# Altium project AltiumSTM32_ExamplePCB.PrjPcb
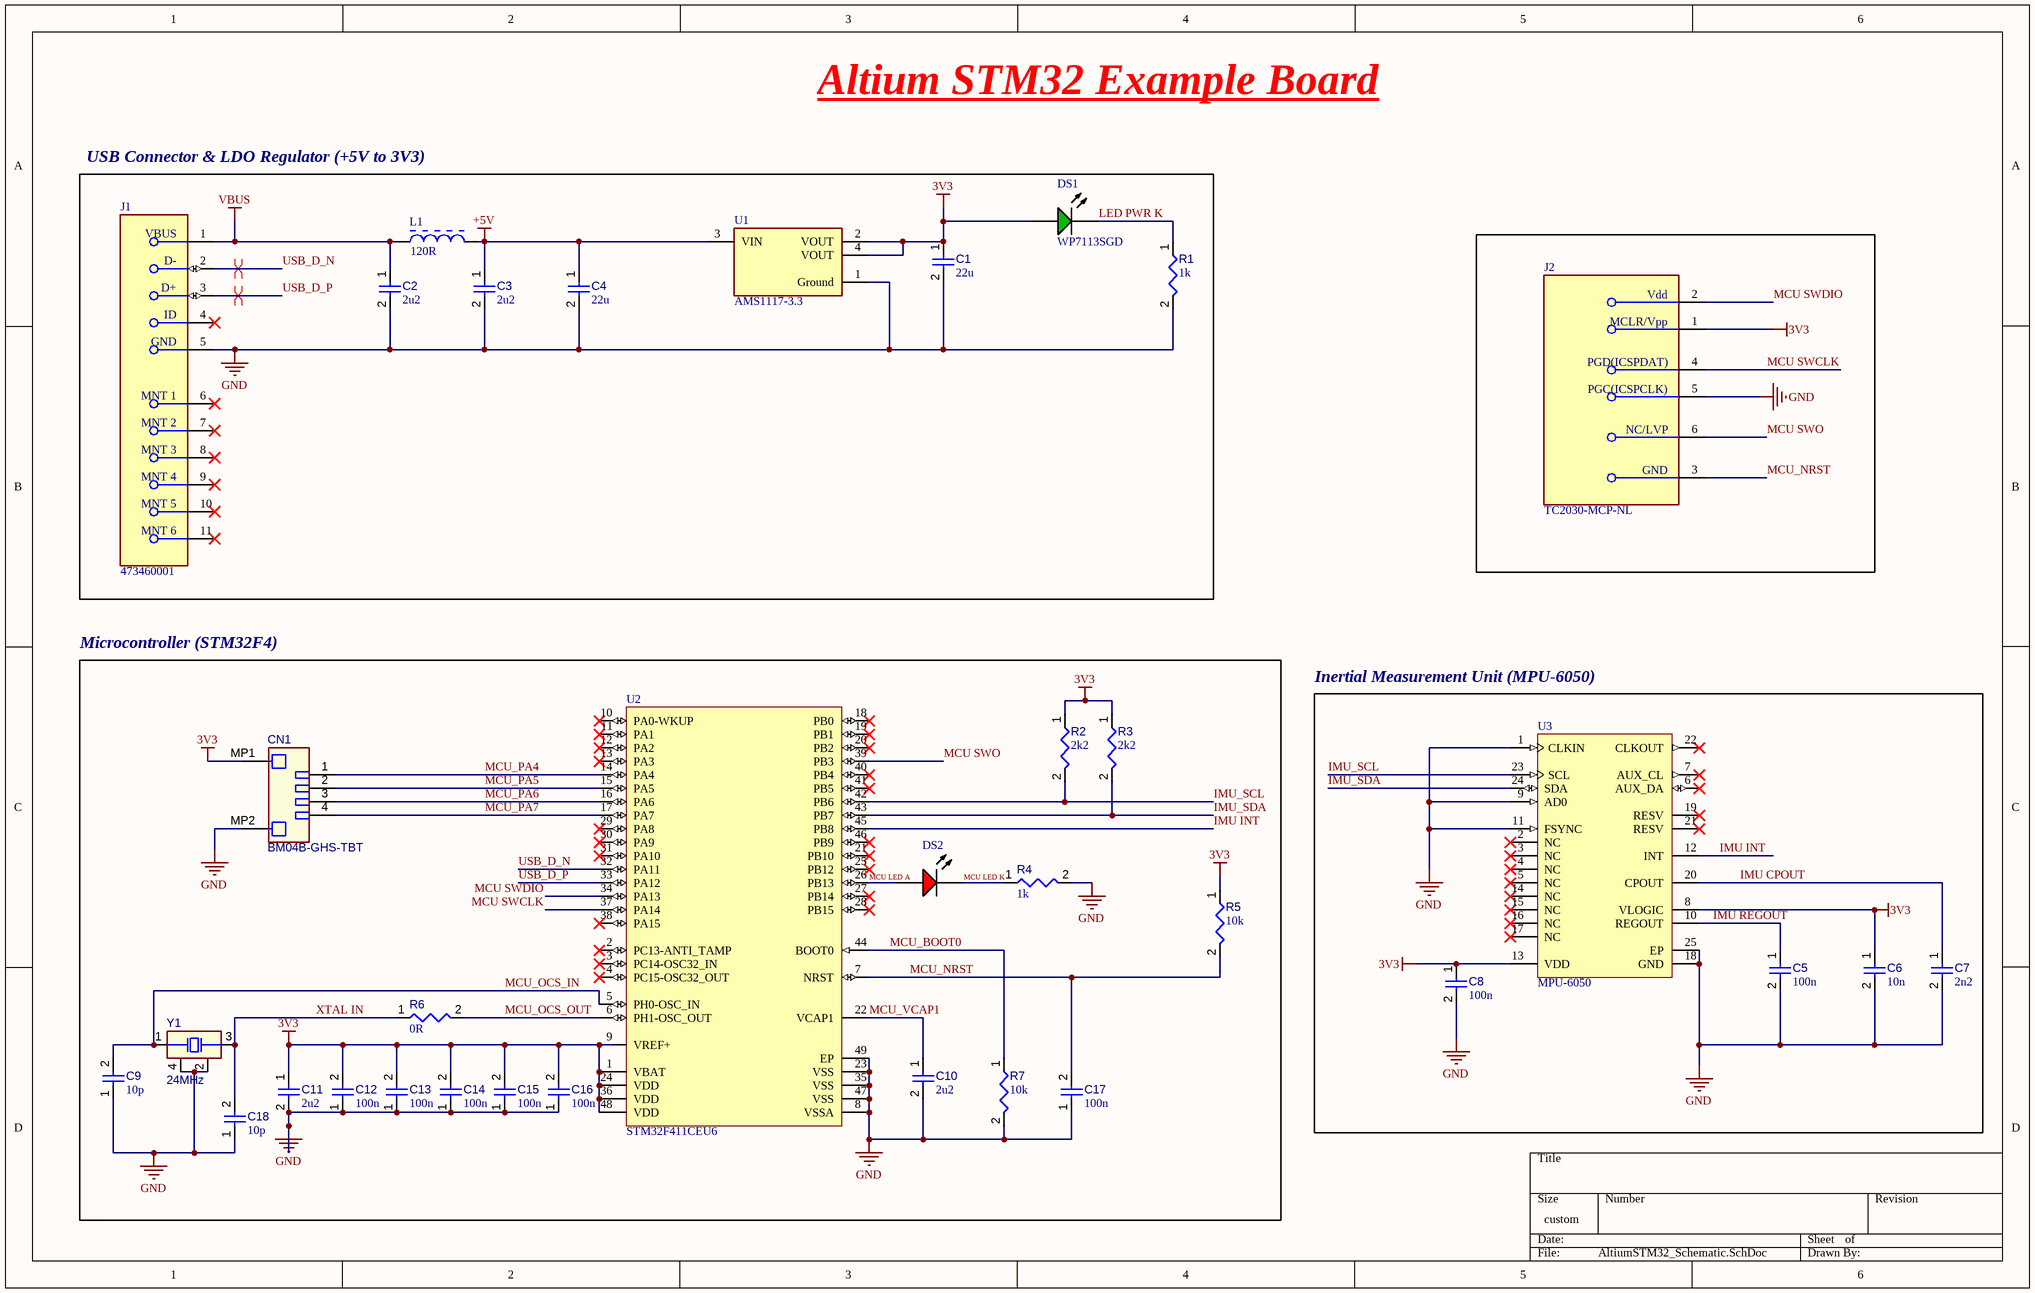
[diagram p0: AltiumSTM32_Schematic.SchDoc]
1 sheet, 35 parts. Net scope: global (net labels, ports and power ports of the same name join across sheets).
Board file: AltiumSTM32_PCB.PcbDoc

## Sheet AltiumSTM32_Schematic.SchDoc
size 381 x 241 mm; SheetNumber: 1; SheetTotal: 1

### Parts
C1  value 22u  [CAPC0805(2012)145_L]  (hidden comment: Capacitor 22µF +/-40% 16V 0805)
C2  value 2u2  [CAPC1608X94X35NL15T15]  (hidden comment: Capacitor 1 uF +/- 10% 16 V 0603)
C3  value 2u2  [CAPC1608X94X35NL15T15]  (hidden comment: Capacitor 1 uF +/- 10% 16 V 0603)
C4  value 22u  [CAPC0805(2012)145_L]  (hidden comment: Capacitor 22µF +/-40% 16V 0805)
C5  value 100n  [CAPC1005X56X25LL10T15]  (hidden comment: Capacitor 0.1 uF +/- 5% 16 V 0402)
C6  value 10n  [CAPC1005X56X25LL10T15]  (hidden comment: Capacitor 0.1 uF +/- 5% 16 V 0402)
C7  value 2n2  [CAPC1005X56X25LL10T15]  (hidden comment: Capacitor 0.1 uF +/- 5% 16 V 0402)
C8  value 100n  [CAPC1005X56X25LL10T15]  (hidden comment: Capacitor 0.1 uF +/- 5% 16 V 0402)
C9  value 10p  [CAPC1005X56X25NL10T15]  (hidden comment: Capacitor 6.8 nF +/- 10% 16 V 0402)
C10  value 2u2  [CAPC1608X94X35NL15T15]  (hidden comment: Capacitor 1 uF +/- 10% 16 V 0603)
C11  value 2u2  [CAPC1608X94X35NL15T15]  (hidden comment: Capacitor 1 uF +/- 10% 16 V 0603)
C12  value 100n  [CAPC1005X56X25LL10T15]  (hidden comment: Capacitor 0.1 uF +/- 5% 16 V 0402)
C13  value 100n  [CAPC1005X56X25LL10T15]  (hidden comment: Capacitor 0.1 uF +/- 5% 16 V 0402)
C14  value 100n  [CAPC1005X56X25LL10T15]  (hidden comment: Capacitor 0.1 uF +/- 5% 16 V 0402)
C15  value 100n  [CAPC1005X56X25LL10T15]  (hidden comment: Capacitor 0.1 uF +/- 5% 16 V 0402)
C16  value 100n  [CAPC1005X56X25LL10T15]  (hidden comment: Capacitor 0.1 uF +/- 5% 16 V 0402)
C17  value 100n  [CAPC1005X56X25LL10T15]  (hidden comment: Capacitor 0.1 uF +/- 5% 16 V 0402)
C18  value 10p  [CAPC1005X56X25NL10T15]  (hidden comment: Capacitor 6.8 nF +/- 10% 16 V 0402)
CN1  BM04B-GHS-TBT  [JST-BM04B-GHS-TBT_V]
DS1  WP7113SGD  [KING-WP7113SGD_V]
DS2  UR502DC  [CGX-UR502DC]  (value not drawn)
J1  473460001  [FP-473460001-MFG]
J2  TC2030-MCP-NL  [FP-TC2030-MCP-NL-MFG]
L1  120R  [MURA-BLM18-F-H1-CHIP-2_V]
R1  value 1k  [RESC0402(1005)_L]  (hidden comment: Resistor 9K1  +/-5 % 0402 63 mW)
R2  value 2k2  [RESC0402(1005)_L]  (hidden comment: Resistor 9K1  +/-5 % 0402 63 mW)
R3  value 2k2  [RESC0402(1005)_L]  (hidden comment: Resistor 9K1  +/-5 % 0402 63 mW)
R4  value 1k  [RESC0402(1005)_L]  (hidden comment: Resistor 9K1  +/-5 % 0402 63 mW)
R5  value 10k  [RESC0402(1005)_L]  (hidden comment: Resistor 9K1  +/-5 % 0402 63 mW)
R6  value 0R  [RESC0402(1005)_L]  (hidden comment: 43D2KR2F)
R7  value 10k  [RESC0402(1005)_L]  (hidden comment: Resistor 9K1  +/-5 % 0402 63 mW)
U1  AMS1117-3.3  [FP-AMS1117-IPC_C]
U2  STM32F411CEU6  [STM-UFQFPN48_L]
U3  MPU-6050  [IS-QFN-24_V]
Y1  24MHz  [EPSON-FA-128_V]

### Blocks framed on the sheet
USB Connector & LDO Regulator (+5V to 3V3): C1-C4 DS1 J1 L1 R1 U1
Microcontroller (STM32F4): C9-C18 CN1 DS2 R2-R7 U2 Y1
Inertial Measurement Unit (MPU-6050): C5-C8 U3

### Nets
3V3: C1.1 C6.1 C8.1 C11.1 C12.2 C13.2 C14.2 C15.2 C16.2 CN1.MP1 DS1.1(A) J2.1(MCLR/Vpp) R2.1 R3.1 R5.1 U1.2(VOUT) U1.4(VOUT) U2.1(VBAT) U2.9(VREF+) U2.24(VDD) U2.36(VDD) U2.48(VDD) U3.8(VLOGIC) U3.13(VDD)
+5V: C3.1 C4.1 L1.2 U1.3(VIN)
GND: C1.2 C2.2 C3.2 C4.2 C5.2 C6.2 C7.2 C8.2 C9.1 C10.2 C11.2 C12.1 C13.1 C14.1 C15.1 C16.1 C17.1 C18.1 CN1.MP2 J1.5(GND) J2.5(PGC(ICSPCLK)) R1.2 R4.2 R7.2 U1.1(Ground) U2.8(VSSA) U2.23(VSS) U2.35(VSS) U2.47(VSS) U2.49(EP) U3.1(CLKIN) U3.9(AD0) U3.11(FSYNC) U3.18(GND) U3.25(EP) Y1.2(NC) Y1.4(NC)
VBUS: C2.1 J1.1(VBUS) L1.1
IMU CPOUT: C7.1 U3.20(CPOUT)
IMU INT: U2.45(PB8) U3.12(INT)
IMU REGOUT: C5.1 U3.10(REGOUT)
IMU_SCL: R2.2 U2.42(PB6) U3.23(SCL)
IMU_SDA: R3.2 U2.43(PB7) U3.24(SDA)
LED PWR K: DS1.2(K) R1.1
MCU LED A: DS2.1(A) U2.26(PB13)
MCU LED K: DS2.2(K) R4.1
MCU SWCLK: J2.4(PGD(ICSPDAT)) U2.37(PA14)
MCU SWDIO: J2.2(Vdd) U2.34(PA13)
MCU SWO: J2.6(NC/LVP) U2.39(PB3)
MCU_BOOT0: R7.1 U2.44(BOOT0)
MCU_NRST: C17.2 J2.3(GND) R5.2 U2.7(NRST)
MCU_OCS_IN: C9.2 U2.5(PH0-OSC_IN) Y1.1(X1)
MCU_OCS_OUT: R6.2 U2.6(PH1-OSC_OUT)
MCU_PA4: CN1.1 U2.14(PA4)
MCU_PA5: CN1.2 U2.15(PA5)
MCU_PA6: CN1.3 U2.16(PA6)
MCU_PA7: CN1.4 U2.17(PA7)
MCU_VCAP1: C10.1 U2.22(VCAP1)
USB_D_N: J1.2(D-) U2.32(PA11)
USB_D_P: J1.3(D+) U2.33(PA12)
XTAL IN: C18.2 R6.1 Y1.3(X2)

Not connected (* = marked no-connect by the designer): J1 4(ID)* 6(MNT_1)* 7(MNT_2)* 8(MNT_3)* 9(MNT_4)* 10(MNT_5)* 11(MNT_6)*; U2 2(PC13-ANTI_TAMP)* 3(PC14-OSC32_IN)* 4(PC15-OSC32_OUT)* 10(PA0-WKUP)* 11(PA1)* 12(PA2)* 13(PA3)* 18(PB0)* 19(PB1)* 20(PB2)* 21(PB10)* 25(PB12)* 27(PB14)* 28(PB15)* 29(PA8)* 30(PA9)* 31(PA10)* 38(PA15)* 40(PB4)* 41(PB5)* 46(PB9)*; U3 2(NC)* 3(NC)* 4(NC)* 5(NC)* 6(AUX_DA)* 7(AUX_CL)* 14(NC)* 15(NC)* 16(NC)* 17(NC)* 19(RESV)* 21(RESV)* 22(CLKOUT)*

### Layout directives
differential pair: USB_D_N, USB_D_P

### Notes on the sheet
- Altium STM32 Example Board

### Library data of the parts
C1 C4 = CMP-001-00081-4: Chip Capacitor, 22µF +/-40%, 16V, 0805, Thickness 1.45 mm; Tolerance: 5%; Voltage Rating: 16V; Mounting Technology: SMT; Pins: 2; Max Operating Temperature: 85°C; Case/Package: 0805; Min Operating Temperature: -55°C
C2 C3 C10 C11 = CMP-001-00003-6: Chip Capacitor, 1 uF, +/- 10%, 16 V, 0603 (1608 Metric); Voltage Rating: 16V; Capacitor Type: Ceramic; Max Operating Temperature: 125°C; Pins: 2; Tolerance: 10%; Min Operating Temperature: -55°C; RoHS Compliant: True; Mounting Technology: SM; Case/Package: 0603
C5-C8 C12-C17 = CMP-001-00001-6: Chip Capacitor, 0.1 uF, +/- 5%, 16 V, 0402 (1005 Metric); Capacitor Type: Ceramic; Voltage Rating: 16V; Max Operating Temperature: 125°C; Min Operating Temperature: -55°C; Case/Package: 0402; Mounting Technology: SM; Pins: 2; Tolerance: 5%; RoHS Compliant: True
C9 C18 = CMP-001-00000-6: Chip Capacitor, 6.8 nF, +/- 10%, 16 V, 0402 (1005 Metric); Capacitor Type: Ceramic; Voltage Rating: 16V; RoHS Compliant: True; Pins: 2; Case/Package: 0402; Min Operating Temperature: -55°C; Tolerance: 10%; Mounting Technology: SM; Max Operating Temperature: 125°C
CN1 = CMP-002-00053-3: Header, Pitch 1.25 mm, 1 x 4 Position, Height 4.05 mm, -25 to 85 degC; Pins: 6
DS1 = CMP-007-00010-2: LED Green, 62.5 mW, 25 mA, -40 to 85 degC, 2-Pin THD, RoHS, Bulk; Manufacturer: Kingbright; Lens Style: Dome; Nominal Vf: 2.2V; Power: 62.5mW; Luminous Intensity: 40mcd; Viewing Angle: 30degrees; Datasheet URL: http://www.kingbrightusa.com/images/catalog/SPEC/WP7113SGD.pdf; Datasheet Version: Rev. 6B, 01/2015; Illumination Colour: Green; Package Quantity: 1000; Package Description: 2-Pin Through Hole Device, Dia 5.9 mm, Body Length 8.6 mm; Colour: Green; Case/Package: Radial; RoHS Compliant: True; Package Reference: WP7113SGD; Mounting Technology: TH; Packaging: Bulk; Forward Voltage: 2.2V
DS2 = CMP-007-00009-2: Red LED, 80 mW, 30 mA, -25 to 85 degC, 2-Pin THD; Manufacturer: Shenzhen CGX; Power: 80mW; Case/Package: UR502DC; RoHS Compliant: Unknown; Package Description: 2-Pin Through Hole Device, Dia 5.9 mm, Height 9.1 mm; Manufacturer URL: http://szcgx.com/; Datasheet Version: Sep-14; Package Reference: UR502DC; Datasheet URL: http://datasheet.octopart.com/UR502DC-Chengguangxing-datasheet-62330342.pdf; Mounting Technology: TH
J1 = CMP-2000-05246-2: CONN RCPT USB2.0 MICRO B SMD R/A; Manufacturer: Molex; Conn Orientation: Right Angle; Is Female: yes; Shielding: true; Pitch: 0.65mm; Number Of Contacts: 5; Voltage Rating: 30V; Current Rating: 1.8A; Device Class L2: USB Connectors; Digikey Description: CONN RCPT USB2.0 MICRO B SMD R/A; Height: 2.945mm; RoHS: TRUE; ComponentLink2Description: Datasheet; Octopart: https://octopart.com/47346-0001-molex-7164928; Automotive: No; Package: 0; Category: Conn; Device Class L1: Connectors; Usb Standard: USB 2.0; Temperature: -30°C to +85°C; Temperature Range Low: -30°C; Footprint Url: https://www.molex.com/pdm_docs/sd/473460001_sd.pdf; ComponentLink2URL: https://www.molex.com/webdocs/datasheets/pdf/en-us/0473460001_IO_CONNECTORS.pdf; Lead Free: Yes; Manufacturer Part Number: 473460001; Contact Material: Gold,Nickel; Temperature Range High: +85°C; Device Class L3: unset
J2 = CMP-205963-000002-1: CABLE TAG-CONNECT IN-CIRCUIT; RoHS Compliant: Yes; Series: -; Reach SVHC Compliant: Yes; Package Quantity: 1; Lead Free: Lead Free
L1 = CMP-006-00004-3: Chip Ferrite Bead for General Use, 120 Ohm, 500 mA, -55 to 125 degC, 0603 (1608 Metric), RoHS, Tape and Reel; Manufacturer: Murata; Max Current Rating: 500mA; Tolerance: 25%; Impedance: 120Ohm; Resistance: 200mohm; Min Operating Temperature: -55°C; Package Reference: BLM18_H950-2; Max Operating Temperature: 125°C; Current Rating: 500mA; Core Material: Ferrite; Datasheet Version: Jun-12; Packaging: TapeandReel; Datasheet URL: https://statics3.seeedstudio.com/images/opl/datasheet/303010016.pdf; Package Quantity: 4000; Case/Package: 0603; RoHS Compliant: True
R1-R5 R7 = CMP-009-00135-3: Chip Resistor, 9,1 kOhms, +/-5 %, 63 mW, -55 to 155 degC, 0402; Power: 63mW; Tolerance: 5%; Pins: 2; Case/Package: 0402; Max Operating Temperature: 155°C; Min Operating Temperature: -55°C
R6 = CMP-009-00100-2: 43K2 0.063W 1% 0402 (1005 Metric)  SMD; Power: 63mW; Mounting Technology: SMT; Tolerance: 1%; Pins: 2; Case/Package: 0402
U1 = CMP-209535-000001-1: LDO Voltage Regulators 1A, 3.3V; Manufacturer: Advanced Monolithic Systems; Dropout Voltage: 1.1V; Output Type: Fixed; Nominal Supply Current: 5mA; Max Power Dissipation: 1.2W; Max Supply Voltage: 15V; Number Of Outputs: 1; Standoff Height: 0.64mm; Max Junction Temp: +125°C; Height: 1.8mm; Package: AMS1117; Device Class L2: Power Management ICs; ComponentLink2Description: Datasheet; ComponentLink2URL: http://www.advanced-monolithic.com/pdf/ds1117.pdf; Category: IC; RoHS: TRUE; Automotive: No; Device Class L1: Integrated Circuits (ICs); Output Current: 1A; Device Class L3: Voltage Regulators - Linear; Temperature: -40°C to +125°C; Output Voltage: 3.3V; Manufacturer Part Number: AMS1117-3.3; Temperature Range Low: -40°C; Octopart: https://octopart.com/ams1117-3.3-advanced+monolithic+systems-25899300; Lead Free: Yes; Ipc Land Pattern Name: SOT229P700X180-4; Temperature Range High: +125°C
U2 = CMP-0243-00165-1: ARM Cortex-M4 32-bit MCU+FPU, 512 KB Flash, 128 KB RAM, 36 I/Os, 48-Pin UFQFPN, -40 to 85 degC, Tray; Operating Frequency(F) (Processor speed) (MHz): 100; FLASH Size (Prog) (kB): 512; Internal RAM Size (kB): 128; I/Os (High Current): 36; Supply Voltage(Vcc) min (V): 1.7; Package Reference: 48-Pin Ultra Thin Fine Pitch Quad Flat No-Lead, 7 x 7 x 0.6 mm Body, 0.5 mm Pitch, Exposed Pad; ComponentLink1Description: Manufacturer URL; ComponentLink1URL: http://www.st.com/; Packing: Tray; Package Description: UFQFPN48; Core: ARM Cortex-M4; ComponentLink2Description: Datasheet; ComponentLink2URL: http://www.st.com/st-web-ui/static/active/en/resource/technical/document/datasheet/DM00115249.pdf; DatasheetVersion: Rev. 6; Mounting Technology: Surface Mount
U3 = CMP-1753-00002-2: 3-Axis Gyroscope, Accelerometer and a Digital Motion Processor(TM) (DMP), 2.375 to 3.46 V, -40 to 85 degC, 24-Pin QFN, RoHS, Tape and Reel; Manufacturer: InvenSense; Featured Product: MPU-60506-Axis,IntegratedI²CSolution; Other Names: 1428-1007-2 / MPU6050; Sensor Type: MotionTracking; Online Catalog: MPU-6000™Series; Unit PriceUSD: Digital; Datasheet Version: Rev. 3.3, 05/2012; Category: Sensors,Transducers; Datasheet URL: http://datasheet.octopart.com/MPU-6050-InvenSense-datasheet-14421344.pdf; Family: Multifunction; Standard Package: 5,000; Manufacturer URL: http://www.invensense.com/; Output Type: Digital; Dynamic Catalog: MPU-6000™Series
Y1 = CMP-003-00028-1: Crystal, 24 MHz, +/- 10 ppm, -20 to 75 degC, 4-Pin SMD, RoHS, Tape and Reel; Load Capacitance: 12pF; ESR: 80; Mounting Technology: SMT; Pins: 4; Case/Package: SMD/SMT; Frequency: 24MHz; Min Operating Temperature: -20°C; RoHS Compliant: Yes; Max Operating Temperature: 75°C